# EAGLE design untitled (EAGLE 9.6.2)
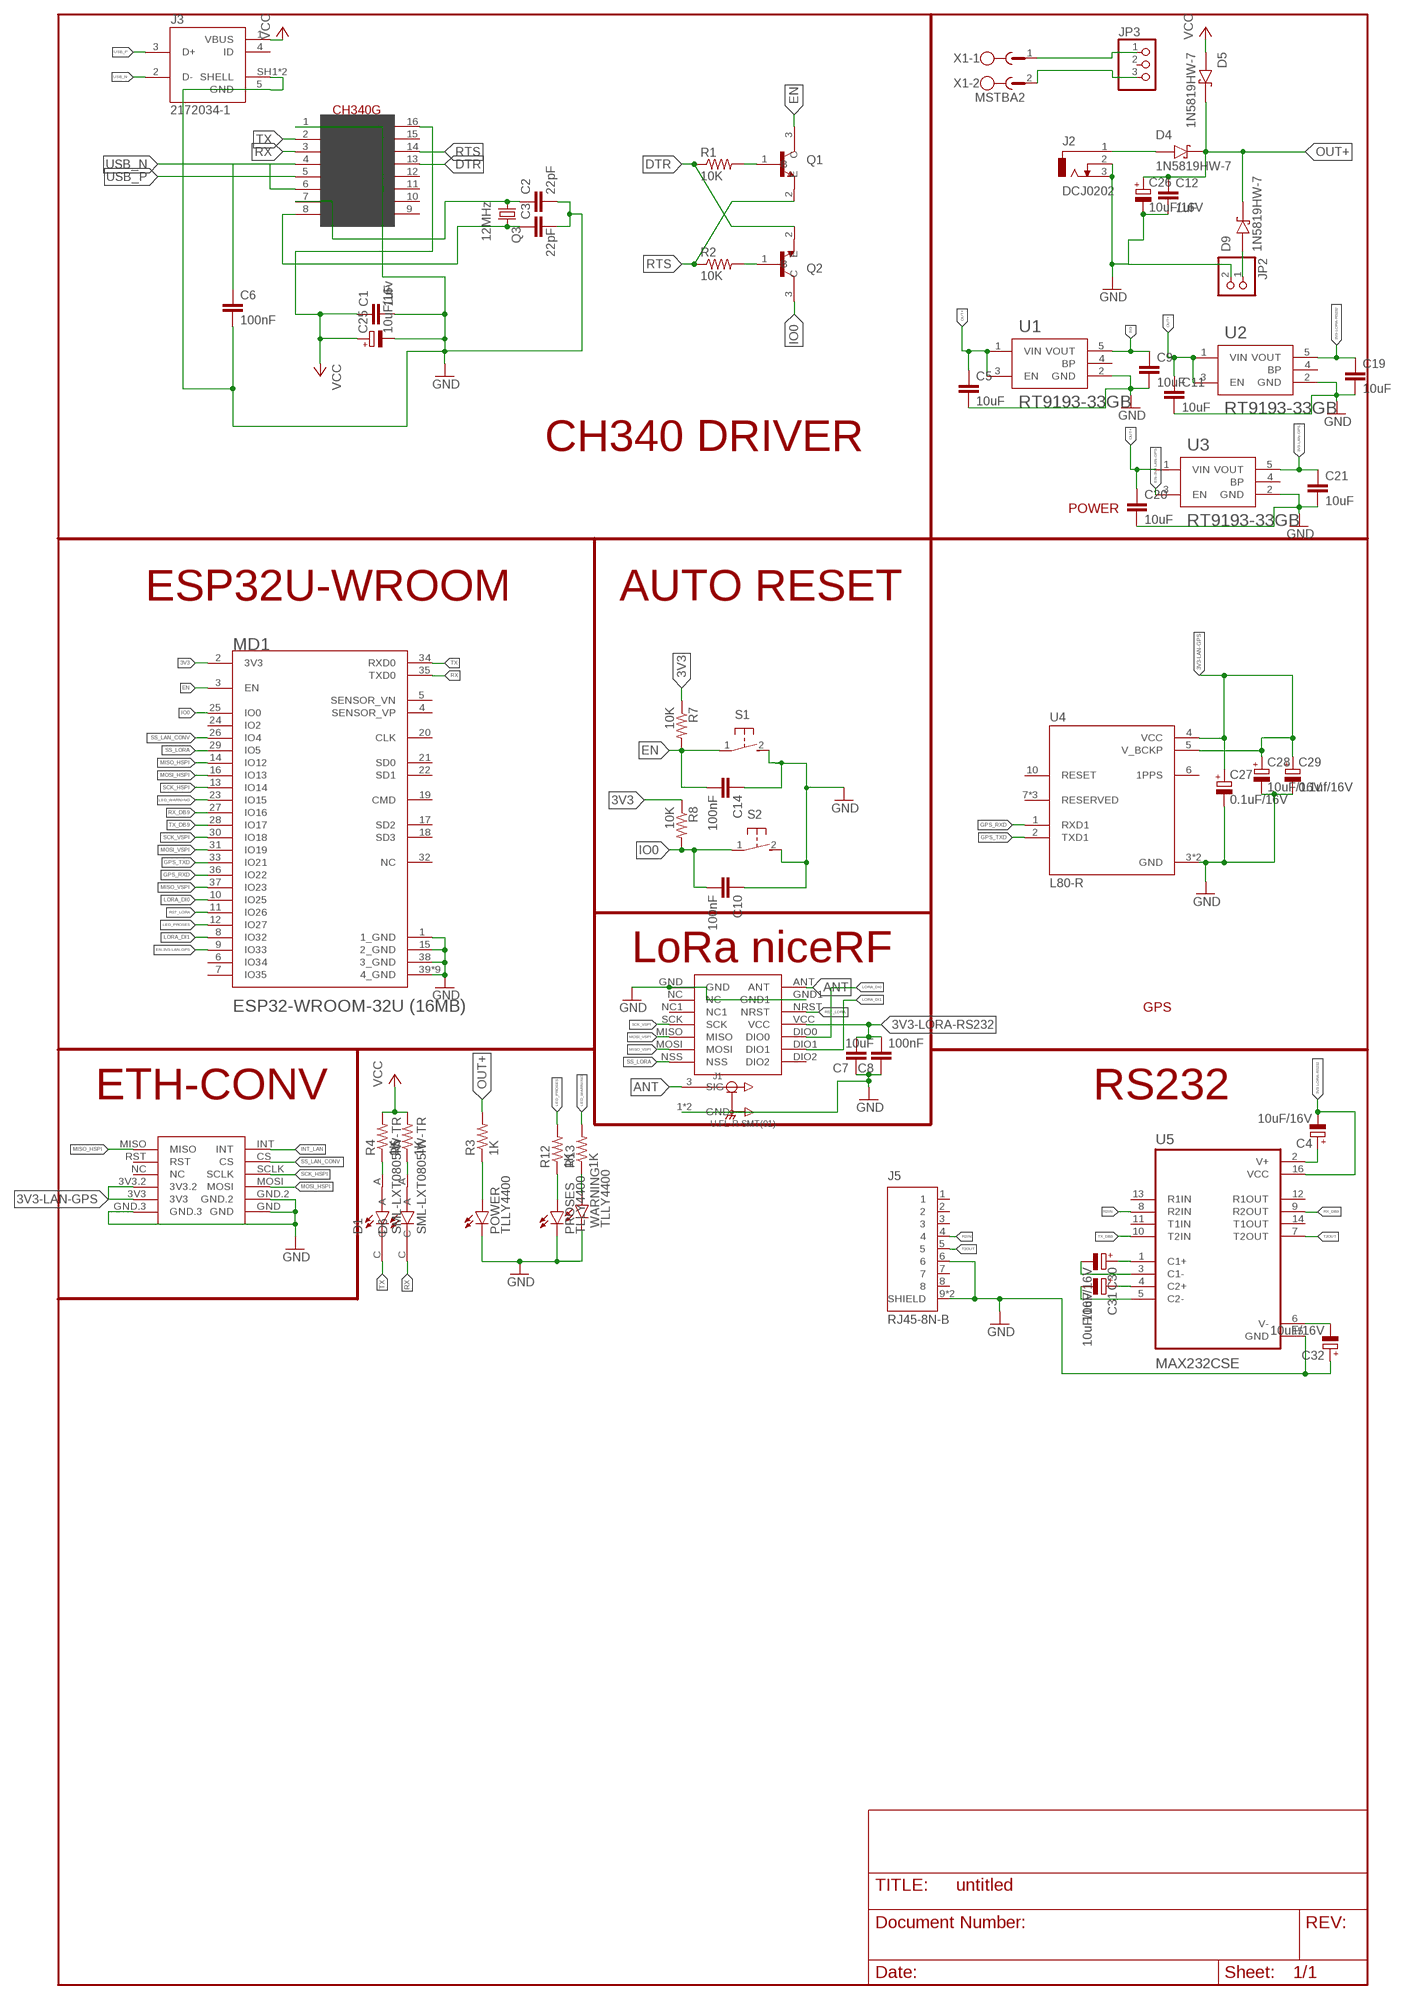
[diagram p0: schematic, sheet 1]

## Parts
C1  1uF  C-EUC0805K  [C0805K]
C2  22pF  C-EUC0805K  [C0805K]
C3  22pF  C-EUC0805K  [C0805K]
C4  10uF/16V  CPOL-EU153CLV-0505  [153CLV-0505]
C5  10uF  C-EUC0805K  [C0805K]
C6  100nF  C-EUC0805K  [C0805K]
C7  10uF  C-EUC0805K  [C0805K]
C8  100nF  C-EUC0805K  [C0805K]
C9  10uF  C-EUC0805K  [C0805K]
C10  100nF  C-EUC0805K  [C0805K]
C11  10uF  C-EUC0805K  [C0805K]
C12  1uF  C-EUC0805K  [C0805K]
C14  100nF  C-EUC0805K  [C0805K]
C19  10uF  C-EUC0805K  [C0805K]
C20  10uF  C-EUC0805K  [C0805K]
C21  10uF  C-EUC0805K  [C0805K]
C25  10uF/16v  CPOL-EU153CLV-0505  [153CLV-0505]
C26  10uF/16V  CPOL-EU153CLV-0505  [153CLV-0505]
C27  0.1uF/16V  CPOL-EU153CLV-0505  [153CLV-0505]
C28  10uF/16V  CPOL-EU153CLV-0505  [153CLV-0505]
C29  0.1uf/16V  CPOL-EU153CLV-0505  [153CLV-0505]
C30  10uF/16V  CPOL-EU153CLV-0505  [153CLV-0505]
C31  10uF/16V  CPOL-EU153CLV-0505  [153CLV-0505]
C32  10uF/16V  CPOL-EU153CLV-0505  [153CLV-0505]
D1  SML-LXT0805IW-TR  [LEDC2012X120N]
D4  1N5819HW-7  [SOD3715X145N]
D5  1N5819HW-7  [SOD3715X145N]
D6  SML-LXT0805IW-TR  [LEDC2012X120N]
D9  1N5819HW-7  [SOD3715X145N]
J1  U.FL-R-SMT(01)  [HRS_U.FL-R-SMT(01)]
J2  DCJ0202  [DCJ0202]
J3  2172034-1  [TE_2172034-1]
J5  RJ45-8N-B  [TE_RJ45-8N-B]
JP2  PINHD-1X2  [1X02]
JP3  PINHD-1X3  [1X03]
LORA-NICERF-V1  LORA-NICERF-V2  [LORA-NICERF-V2]
MD1  ESPRESSIF_SYSTEMS_ESP32-WROOM-32U_16MBESPRESSIF_SYSTEMS_ESP32-WROOM-32U_16MB_0_0  [ESPRESSIF_SYSTEMS_ESP32-WROOM-32U_16MB_0]
POWER  TLLY4400  [LED3MM]
PROSES  TLLY4400  [LED3MM]
Q1  MMBT3904  [SOT95P240X120-3N]
Q2  MMBT3904  [SOT95P240X120-3N]
Q3  12MHz  CRYSTALSM49  [SM49]
R1  10K  R-US_M0805  [M0805]
R2  10K  R-US_M0805  [M0805]
R3  1K  R-US_M0805  [M0805]
R4  1K  R-US_M0805  [M0805]
R5  1K  R-US_M0805  [M0805]
R7  10K  R-US_M0805  [M0805]
R8  10K  R-US_M0805  [M0805]
R12  1K  R-US_M0805  [M0805]
R13  1K  R-US_M0805  [M0805]
S1  31-XX  [B3F-31XX]
S2  31-XX  [B3F-31XX]
U1  RT9193-33GB  [SOT94P279X129-5N]
U2  RT9193-33GB  [SOT94P279X129-5N]
U3  RT9193-33GB  [SOT94P279X129-5N]
U4  L80-R  [XCVR_L80-R]
U5  MAX232CSE  [SOIC127P600X175-16N]
U$2  CH340G  [SOIC16]
U$3  MINI_W5500  [MINI_W5500]
WARNING  TLLY4400  [LED3MM]
X1  MSTBA2  [MSTBA2]

## Nets
3V3: C9.1 MD1.2(3V3) R7.1 R8.1 U1.5(VOUT)
3V3-LAN-GPS: C21.1 C27.+ C28.+ C29.+ U3.5(VOUT) U4.4(VCC) U4.5(V_BCKP) U$3.3V3 U$3.3V3.2
3V3-LORA-RS232: C4.- C7.2 C8.2 C19.1 LORA-NICERF-V1.VCC U2.5(VOUT) U5.16(VCC)
ANT: J1.3(SIG) LORA-NICERF-V1.ANT
DTR: Q2.2(E) R1.1 U$2.13(DTR)
EN: C14.2 MD1.3(EN) Q1.3(C) R7.2 S1.1(P)
EN-3V3-LAN-GPS: MD1.9(IO33) U3.3(EN)
GND: C1.2 C2.2 C3.2 C5.2 C6.2 C7.1 C8.1 C9.2 C10.1 C11.2 C12.2 C14.1 C19.2 C20.2 C21.2 C25.- C26.- C27.- C28.- C29.- C32.+ J1.1(GND) J1.2(GND) J2.2 J2.3 J3.5(GND) J3.SH1(SHELL) J3.SH2(SHELL) J5.6 J5.9(SHIELD) J5.10(SHIELD) JP2.2 LORA-NICERF-V1.GND LORA-NICERF-V1.GND1 MD1.1(1_GND) MD1.15(2_GND) MD1.38(3_GND) MD1.39(4_GND) MD1.39-2(4_GND) MD1.39-3(4_GND) MD1.39-4(4_GND) MD1.39-5(4_GND) MD1.39-6(4_GND) MD1.39-7(4_GND) MD1.39-8(4_GND) MD1.39-9(4_GND) POWER.K(C) PROSES.K(C) S1.2(S) S2.2(S) U1.2(GND) U2.2(GND) U3.2(GND) U4.3(GND) U4.12(GND) U5.15(GND) U$2.1(GND) U$3.GND U$3.GND.2 U$3.GND.3 WARNING.K(C)
GPS_RXD: MD1.36(IO22) U4.1(RXD1)
GPS_TXD: MD1.33(IO21) U4.2(TXD1)
INT_LAN: U$3.INT
IO0: C10.2 MD1.25(IO0) Q2.3(C) R8.2 S2.1(P)
LED_PROSES: MD1.12(IO27) R12.2
LED_WARNING: MD1.23(IO15) R13.2
LORA_DI0: LORA-NICERF-V1.DIO0 MD1.10(IO25)
LORA_DI1: LORA-NICERF-V1.DIO1 MD1.8(IO32)
MISO_HSPI: MD1.14(IO12) U$3.MISO
MISO_VSPI: LORA-NICERF-V1.MOSI MD1.37(IO23)
MOSI_HSPI: MD1.16(IO13) U$3.MOSI
MOSI_VSPI: LORA-NICERF-V1.MISO MD1.31(IO19)
N$1: C2.1 Q3.1 U$2.7(XI)
N$2: C3.1 Q3.2 U$2.8(XO)
N$3: POWER.A R3.1
N$4: Q1.1(B) R1.2
N$5: Q2.1(B) R2.2
N$6: D4.A J2.1
N$8: D1.A R4.1
N$9: D6.A R5.1
N$10: C30.+ U5.1(C1+)
N$12: C6.1 U$2.4(V3)
N$13: JP3.1 X1.1
N$14: C30.- U5.3(C1-)
N$16: JP3.3 X1.2
N$17: D9.A JP2.1
N$19: C31.+ U5.4(C2+)
N$24: C31.- U5.5(C2-)
N$25: PROSES.A R12.1
N$26: C4.+ U5.2(V+)
N$27: C32.- U5.6(V-)
N$28: R13.1 WARNING.A
OUT+: C5.1 C11.1 C12.1 C20.1 C26.+ D4.C(K) D5.C(K) D9.C(K) R3.2 U1.1(VIN) U1.3(EN) U2.1(VIN) U2.3(EN) U3.1(VIN)
R2IN: J5.4 U5.8(R2IN)
RST_LORA: LORA-NICERF-V1.NRST MD1.11(IO26)
RTS: Q1.2(E) R2.1 U$2.14(RTS)
RX: D6.C MD1.35(TXD0) U$2.3(RX)
RX_DB9: MD1.27(IO16) U5.9(R2OUT)
SCK_HSPI: MD1.13(IO14) U$3.SCLK
SCK_VSPI: LORA-NICERF-V1.SCK MD1.30(IO18)
SS_LAN_CONV: MD1.26(IO4) U$3.CS
SS_LORA: LORA-NICERF-V1.NSS MD1.29(IO5)
T2OUT: J5.5 U5.7(T2OUT)
TX: D1.C MD1.34(RXD0) U$2.2(TX)
TX_DB9: MD1.28(IO17) U5.10(T2IN)
USB_N: J3.2(D-) U$2.6(D-)
USB_P: J3.3(D+) U$2.5(D+)
VCC: C1.1 C25.+ D5.A J3.1(VBUS) R4.2 R5.2 U$2.16(VCC)
Unconnected: J3.4(ID) J5.1 J5.2 J5.3 J5.7 J5.8 JP3.2 LORA-NICERF-V1.DIO2 LORA-NICERF-V1.NC LORA-NICERF-V1.NC1 MD1.4(SENSOR_VP) MD1.5(SENSOR_VN) MD1.6(IO34) MD1.7(IO35) MD1.17(SD2) MD1.18(SD3) MD1.19(CMD) MD1.20(CLK) MD1.21(SD0) MD1.22(SD1) MD1.24(IO2) MD1.32(NC) U1.4(BP) U2.4(BP) U3.4(BP) U4.6(1PPS) U4.7(RESERVED) U4.8(RESERVED) U4.10(RESET) U4.11(RESERVED) U5.11(T1IN) U5.12(R1OUT) U5.13(R1IN) U5.14(T1OUT) U$2.9(CTS) U$2.10(DSR) U$2.11(RI) U$2.12(DCD) U$2.15(RS232) U$3.NC U$3.RST

## Notes on the sheet
- CH340 DRIVER
- POWER
- ESP32U-WROOM | AUTO RESET
- LoRa niceRF
- GPS
- ETH-CONV | RS232

## Library data of the parts
C1-C3 C5-C12 C14 C19-C21 = rcl:C-EU: CAPACITOR, European symbol; SPICEPREFIX: C
C4 C25-C32 = rcl:CPOL-EU: POLARIZED CAPACITOR, European symbol; SPICEPREFIX: C
D1 D6 = SML-LXT0805IW-TR:SML-LXT0805IW-TR: LED; Luminous Intensity:11µcd; Viewing Angle:140°; Forward Current:30mA; Forward Voltage:2V; Color:Red; LED Color:Red; Leaded Process Compatible:Yes; Lens Color:White; Mounting Type:Surface Mount ;RoHS Compliant: Yes Check availability <https://pricing.snapeda.com/parts/SML-LXT0805IW-TR/Lumex%20Opto/Components/view-part?ref=eda>; AVAILABILITY: In Stock; DESCRIPTION: Red - LED Indication - Discrete 2V 0805 (2012 Metric); MF: Lumex Opto/Components; MP: SML-LXT0805IW-TR; PACKAGE: 0805 Lumex; PRICE: None; PURCHASE-URL: https://pricing.snapeda.com/search/part/SML-LXT0805IW-TR/?ref=eda
D4 D5 D9 = 1N5819HW-7:1N5819HW-7: 1N5819HW Series 40 V 1 A Surface Mount Schottky Barrier Rectifier - SOD-123 Check availability <https://pricing.snapeda.com/parts/1N5819HW-7/Diodes%20Inc./view-part?ref=eda>; AVAILABILITY: In Stock; DESCRIPTION: Diode Schottky 40 V 1A Surface Mount SOD-123; MF: Diodes Inc.; MP: 1N5819HW-7; PACKAGE: SOD-123 Fairchild Semiconductor; PRICE: None; PURCHASE-URL: https://pricing.snapeda.com/search/part/1N5819HW-7/?ref=eda
J1 = U.FL-R-SMT_01_:U.FL-R-SMT(01): U.FL Series 6 Ghz 50 Ohm Ultra-small SMT Coaxial Cable Receptacle Check availability <https://pricing.snapeda.com/parts/U.FL-R-SMT%2801%29/Hirose/view-part?ref=eda>; AVAILABILITY: In Stock; DESCRIPTION: U.FL (UMCC) Connector Receptacle, Male Pin 50Ohm Surface Mount Solder. RF Connectors / Coaxial Connectors; MF: Hirose; MP: U.FL-R-SMT(01); PACKAGE: None; PRICE: None; PURCHASE-URL: https://pricing.snapeda.com/search/part/U.FL-R-SMT(01)/?ref=eda
J2 = con-jack:DCJ0202: DC POWER JACK Source: DCJ0202.pdf; OC_FARNELL: unknown; OC_NEWARK: unknown
J3 = 2172034-1:2172034-1: CONN RCPT USB MINI B 2.0 PCB R/A Check availability <https://pricing.snapeda.com/parts/2172034-1/TE%20Connectivity/view-part?ref=eda>; AVAILABILITY: In Stock; COMMENT: 2172034-1; DESCRIPTION: Conn Mini USB Type B RCP 5 POS 0.8mm Solder RA Thru-Hole 5 Terminal 1 Port Box/Tray; EU_ROHS_COMPLIANCE: Compliant; MF: TE Connectivity; MP: 2172034-1; PACKAGE: None; PRICE: None; PURCHASE-URL: https://pricing.snapeda.com/search/part/2172034-1/?ref=eda
J5 = RJ45-8N-B:RJ45-8N-B: RJ Jack / Signal Line EMI/RFI Filters 6 TERM LOW PROFILE BLOCK INDUCTOR 8 PIN Check availability <https://pricing.snapeda.com/parts/RJ45-8N-B/TE%20Connectivity/view-part?ref=eda>; AVAILABILITY: In Stock; DESCRIPTION: Jack Modular Connector 8p8c (RJ45, Ethernet) 90° Angle (Right) Unshielded -; MF: TE Connectivity; MP: RJ45-8N-B; PACKAGE: None; PRICE: None; PURCHASE-URL: https://pricing.snapeda.com/search/part/RJ45-8N-B/?ref=eda
JP2 = pinhead:PINHD-1X2: PIN HEADER
JP3 = pinhead:PINHD-1X3: PIN HEADER
LORA-NICERF-V1 = LORA-NICERF-V2:LORA-NICERF-V2
MD1 = Espressif Systems - ESP32-WROOM-32U (16MB):ESPRESSIF_SYSTEMS_ESP32-WROOM-32U_16MB: Bluetooth, WiFi 802.11b/g/n, Bluetooth v4.2 +EDR, Class 1, 2 and 3 Transceiver Module 2.4GHz ~ 2.5GHz Antenna Not Included, U.FL Surface Mount; AUTOMOTIVE: No; BANDWIDTH: 72MHz; CENTROID_NOT_SPECIFIED: No; DATASHEET: https://www.espressif.com/sites/default/files/documentation/esp32-wroom-32d_esp32-wroom-32u_datasheet_en.pdf; DATA_RATE: 150Mbits/s; DEVICE_CLASS_L1: Integrated Circuits (ICs); DEVICE_CLASS_L2: RF Semiconductors and Devices; DEVICE_CLASS_L3: Transceivers; DIGIKEY_DESCRIPTION: RX TXRX MODULE WIFI U.FL SMD; DIGIKEY_PART_NUMBER: 1904-1028-1-ND; FOOTPRINT_VARIANT_NAME_0: Recommended_Land_Pattern; HEIGHT: 3.35mm; INTERFACE: I2C,SPI,UART,Ethernet,I2S,Other; LEAD_FREE: Yes; MAX_FREQUENCY: 2484MHz; MAX_SUPPLY_VOLTAGE: 3.6V; MF: Espressif Systems; MFG_PACKAGE_IDENT: 0; MFG_PACKAGE_IDENT_DATE: 0; MFG_PACKAGE_IDENT_REV: 0; MIN_SUPPLY_VOLTAGE: 3V; MOUSER_PART_NUMBER: 356-ES32WROOM32U16MB; MPN: ESP32-WROOM-32U (16MB); NOMINAL_SUPPLY_CURRENT: 0.5A; NUMBER_OF_ADC_CHANNELS: 16; NUMBER_OF_GPIO: 26; PACKAGE: BT_MODULE; PREFIX: MD; ROHS: Yes; SENSITIVITY: -98dBm; TEMPERATURE_RANGE_HIGH: +85°C; TEMPERATURE_RANGE_LOW: -40°C; VERIFICATION_VERSION: 0.0.0.3
POWER PROSES WARNING = led:TLLY4400: Low Current (2mA) LED 3 mm Tinted Diffused Package color YELLOW Source: Data sheet <http://www.farnell.com/datasheets/391098.pdf>; MF: VISHAY SEMICONDUCTOR; OC_FARNELL: 1612439
Q1 Q2 = MMBT3904:MMBT3904: MMBT3904 Series 40 V CE Breakdown 0.2 A NPN General Purpose Amplifier - SOT-23 Check availability <https://pricing.snapeda.com/parts/MMBT3904/STMicroelectronics/view-part?ref=eda>; AVAILABILITY: Not in stock; DESCRIPTION: SMD Transistor MMBT3904 SOT-23 SMD DIOTEC; MF: STMicroelectronics; MP: MMBT3904; PACKAGE: SOT-23 ON; PRICE: None
Q3 = adafruit:CRYSTAL: CRYSTAL; OC_FARNELL: unknown; OC_NEWARK: unknown
R1-R5 R7 R8 R12 R13 = adafruit:R-US_: RESISTOR, American symbol
S1 S2 = switch-omron:31-XX: OMRON SWITCH; MPN: B3F-3100; OC_FARNELL: 959704; OC_NEWARK: 36M3582
U1-U3 = RT9193-33GB:RT9193-33GB: RT9193 Series 300 mA 3.3 V Ultra-Low Noise Ultra-Fast CMOS LDO Regulator-SC-70-5 Check availability <https://pricing.snapeda.com/parts/RT9193-33GB/Richtek%20USA%20Inc./view-part?ref=eda>; AVAILABILITY: In Stock; DESCRIPTION: Linear Voltage Regulator IC Positive Fixed 1 Output 300mA SOT-23-5; MF: Richtek USA Inc.; MP: RT9193-33GB; PACKAGE: SOT-23-5 Richtek; PRICE: None; PURCHASE-URL: https://pricing.snapeda.com/search/part/RT9193-33GB/?ref=eda
U4 = L80-R:L80-R: Check availability <https://pricing.snapeda.com/parts/L80-R/Quectel/view-part?ref=eda>; AVAILABILITY: In Stock; DESCRIPTION: L80-R is an ultra compact GPS POT (Patch on Top) module with an embedded 15.0mm × 15.0mm × 4.0mm patch antenna; MF: Quectel; MP: L80-R; PACKAGE: None; PRICE: None
U5 = MAX232CSE:MAX232CSE: Check availability <https://pricing.snapeda.com/parts/MAX232CSE/Maxim%20Integrated/view-part?ref=eda>; AVAILABILITY: In Stock; DESCRIPTION: 2/2 Transceiver Full RS232 16-SOIC; MF: Maxim Integrated; MP: MAX232CSE; PACKAGE: SOIC-16 Maxim Integrated; PRICE: None; PURCHASE-URL: https://pricing.snapeda.com/search/part/MAX232CSE/?ref=eda
U$2 = usb-serial:CH340G
U$3 = ethernet-mikroavr:MINI_W5500: MINI ETHERNET W5500, CREATE BY MIKROAVR.COM
X1 = con-phoenix-508:MSTBA2: PHOENIX; MF: FARNELL; MPN: 1757242; OC_FARNELL: 3705171; OC_NEWARK: 71C4161

## Net classes
0 default: width 0.2 mm, clearance 0.2 mm

## Board
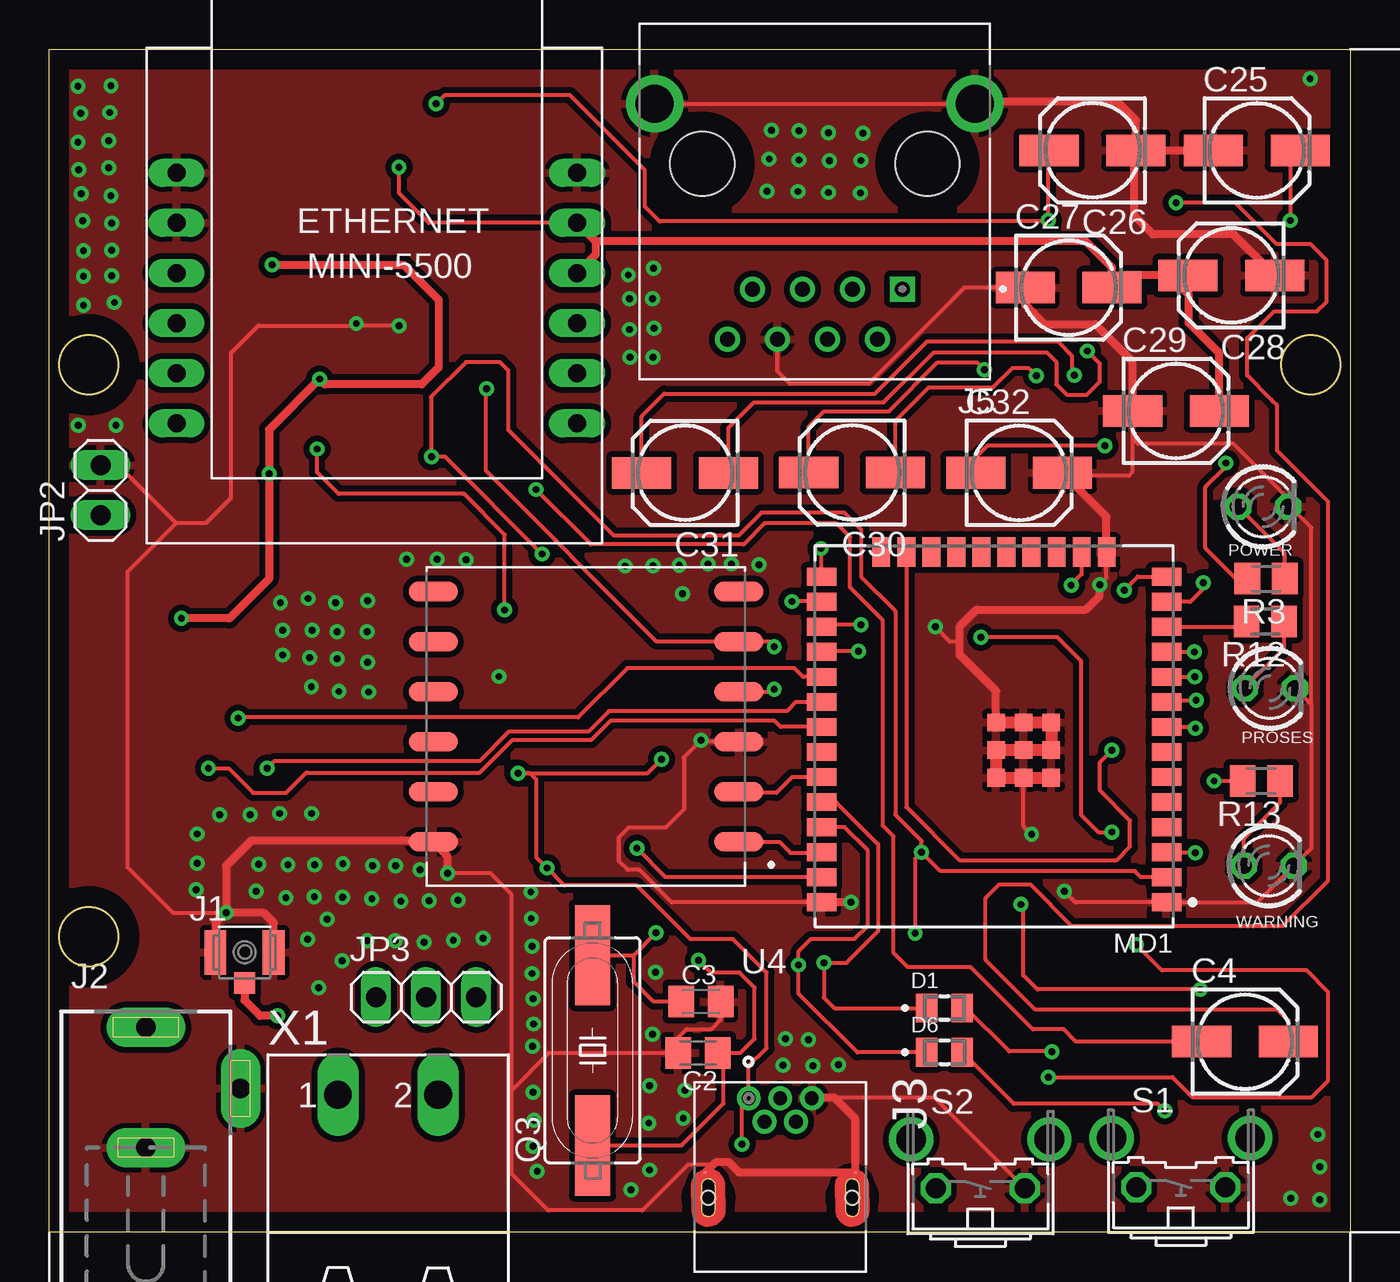
[diagram p1: board, top side]
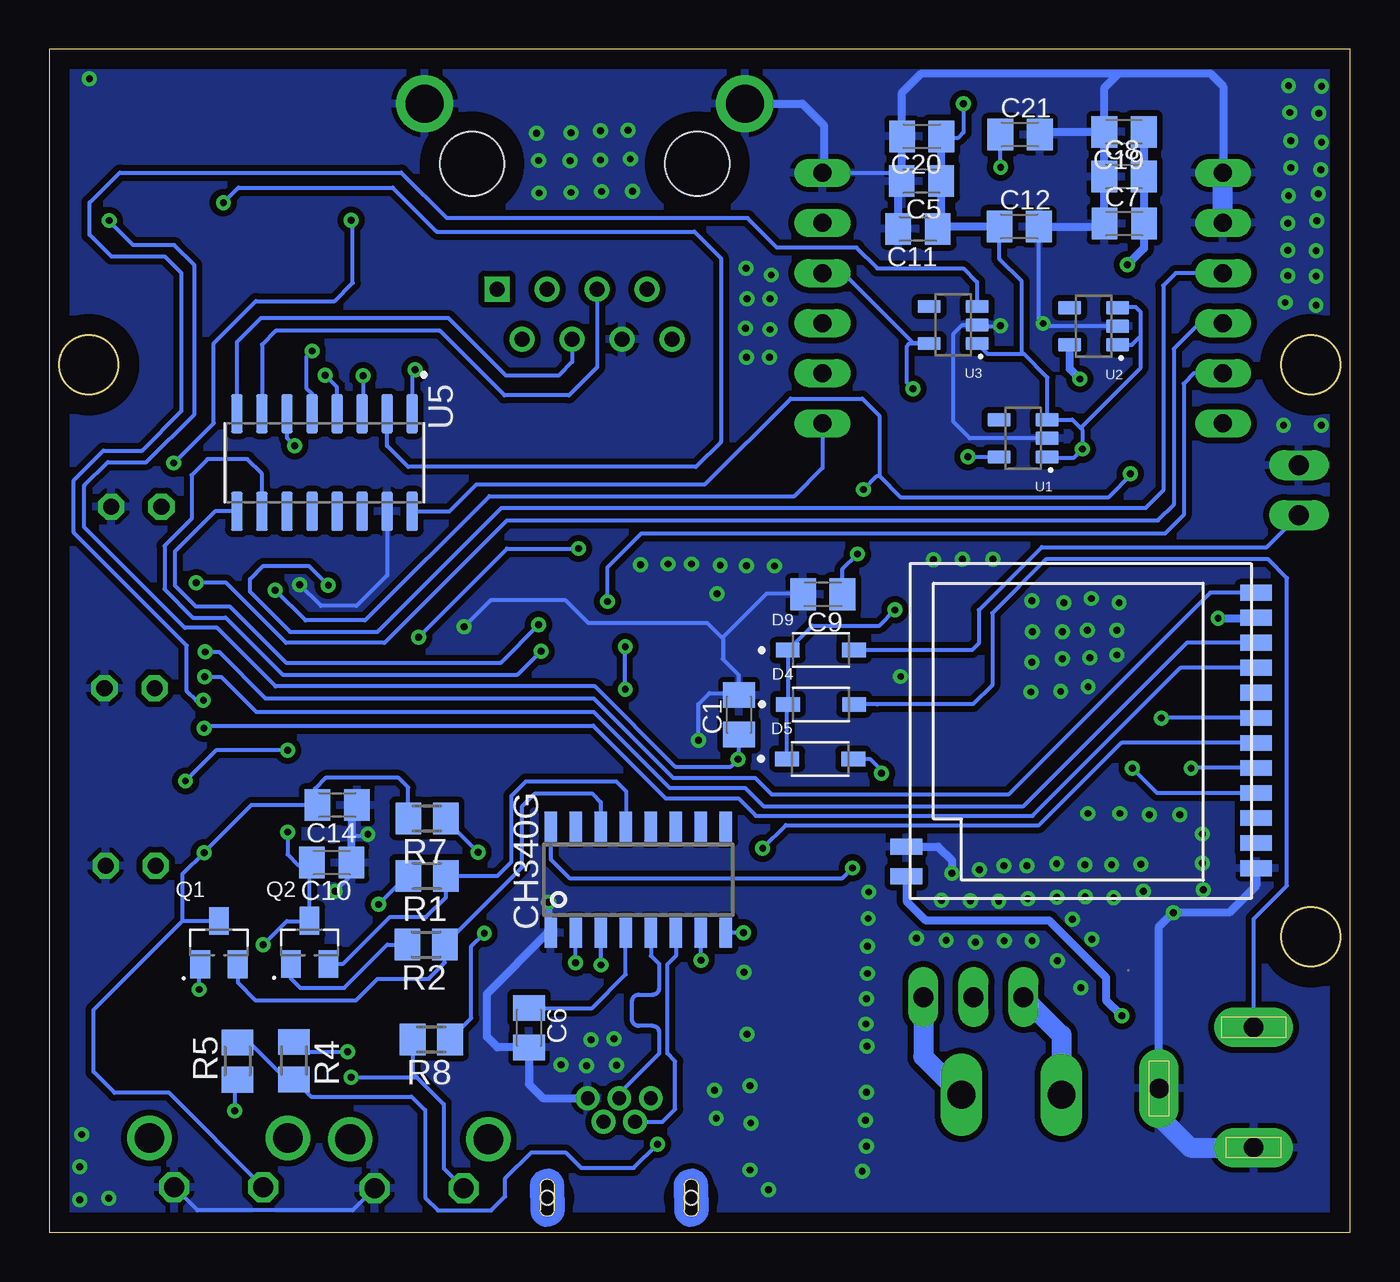
[diagram p2: board, bottom side, seen from below]

Size 66 x 60 mm. Coordinates in mm from the lower left corner, seen from the top.
Outline: 0,0 0,60 66,60 66,0 0,0
Outline: circle at 64,44 radius 1.5
Outline: circle at 2,15 radius 1.5
Outline: circle at 2,44 radius 1.5
Copper layers (1*16): Top 0.035mm / dielectric 1.5mm / Bottom 0.035mm
Design rules "default": minimum track width 6mil, minimum drill 0.35mm, track to track 6mil, track to pad 6mil, pad to pad 6mil, via to via 6mil, smd to smd 6mil, copper to edge 40mil, drill to drill 6mil, minimum pad ring 10mil, minimum via ring 8mil, stop-mask expansion 4mil, vias tented up to drill 0mil, thermal gap 10mil

### Footprints (pad centres in the part's own frame; a part is rotated, then mirrored left to right if it is on the bottom)
C0805K = smd 1.3 x 1.6: 1 -1,0; 2 1,0
153CLV-0505 = smd 3 x 1.6: + 2.2,0; - -2.2,0
LEDC2012X120N = smd 1.1 x 1.45: A 0.9,0; C -0.9,0
SOD3715X145N = smd 1.21 x 0.73: A 1.68,0; C -1.68,0
HRS_U.FL-R-SMT(01) = smd 1.1 x 2.25: 1 -1.475,0; 2 1.475,0 | smd 1.05 x 1.1: 3 0,-1.55
DCJ0202 = drill 1 pad 2 long: 1 0,3.1; 2 4.8,0; 3 0,-3
TE_2172034-1 = drill 0.7: 1 -5.05,-1.6; 2 -3.85,-0.8; 3 -5.05,0; 4 -3.85,0.8; 5 -5.05,1.6 | smd 0.1 x 0.1: SH1 -1.27,3.81; SH2 -1.27,-3.81 | hole 0.7: 0,3.65; 0,-3.65
TE_RJ45-8N-B = drill 0.76 square: 1 -4.445,6.35 | drill 0.76: 2 -3.175,8.89; 3 -1.905,6.35; 4 -0.635,8.89; 5 0.635,6.35; 6 1.905,8.89; 7 3.175,6.35; 8 4.445,8.89 | drill 1.93: 9 -8.125,-3.05; 10 8.125,-3.05 | hole 3.25: -5.715,0; 5.715,0
1X02 = drill 1.016 long: 1 -1.27,0; 2 1.27,0
1X03 = drill 1.016 long: 1 -2.54,0; 2 0,0; 3 2.54,0
LORA-NICERF-V2 = smd 1.6 x 0.8: ANT 9.17,6.81; DIO0 -8.57,-5.03; DIO1 -8.57,-3.76; DIO2 -8.57,-2.49; GND -8.57,6.4; GND1 9.17,5.31; MISO -8.57,1.32; MOSI -8.57,0.05; NC -8.57,5.13; NC1 -8.57,3.86; NRST -8.57,-7.57; NSS -8.57,-1.22; SCK -8.57,2.59; VCC -8.57,-6.3
ESPRESSIF_SYSTEMS_ESP32-WROOM-32U_16MB_0 = smd 1.5 x 0.9: 1 -8.75,8.41; 2 -8.75,7.14; 3 -8.75,5.87; 4 -8.75,4.6; 5 -8.75,3.33; 6 -8.75,2.06; 7 -8.75,0.79; 8 -8.75,-0.48; 9 -8.75,-1.75; 10 -8.75,-3.02; 11 -8.75,-4.29; 12 -8.75,-5.56; 13 -8.75,-6.83; 14 -8.75,-8.1; 25 8.75,-8.1; 26 8.75,-6.83; 27 8.75,-5.56; 28 8.75,-4.29; 29 8.75,-3.02; 30 8.75,-1.75; 31 8.75,-0.48; 32 8.75,0.79; 33 8.75,2.06; 34 8.75,3.33; 35 8.75,4.6; 36 8.75,5.87; 37 8.75,7.14; 38 8.75,8.41 | smd 0.9 x 1.5: 15 -5.71,-9.35; 16 -4.44,-9.35; 17 -3.17,-9.35; 18 -1.9,-9.35; 19 -0.63,-9.35; 20 0.64,-9.35; 21 1.91,-9.35; 22 3.18,-9.35; 23 4.45,-9.35; 24 5.72,-9.35 | smd 0.9 x 0.9: 39 -2.9,2.09; 39-2 -1.5,0.69; 39-3 -1.5,2.09; 39-4 -0.1,2.09; 39-5 -0.1,-0.71; 39-6 -1.5,-0.71; 39-7 -2.9,-0.71; 39-8 -0.1,0.69; 39-9 -2.9,0.69
LED3MM = drill 0.813 octagon: A -1.27,0; K 1.27,0
SOT95P240X120-3N = smd 1 x 1.4: 1 -0.95,-1.1; 2 0.95,-1.1; 3 0,1.1
SM49 = smd 5.08 x 1.778: 1 -4.826,0; 2 4.826,0
M0805 = smd 1.3 x 1.6: 1 -0.95,0; 2 0.95,0
B3F-31XX = drill 1.016 octagon: 1 -2.261,-1.245; 2 2.261,-1.245 | drill 1.499 pad 2.159: 3 -3.505,1.245; 4 3.505,1.245
SOT94P279X129-5N = smd 1.17 x 0.67: 1 -1.22,0.94; 2 -1.22,0; 3 -1.22,-0.94; 4 1.22,-0.94; 5 1.22,0.94
XCVR_L80-R = smd 2.5 x 1: 1 -7.75,6.35; 2 -7.75,3.81; 3 -7.75,1.27; 4 -7.75,-1.27; 5 -7.75,-3.81; 6 -7.75,-6.35; 7 7.75,-6.35; 8 7.75,-3.81; 9 7.75,-1.27; 10 7.75,1.27; 11 7.75,3.81; 12 7.75,6.35
SOIC127P600X175-16N = smd 1.97 x 0.59: 1 -2.475,4.445; 2 -2.475,3.175; 3 -2.475,1.905; 4 -2.475,0.635; 5 -2.475,-0.635; 6 -2.475,-1.905; 7 -2.475,-3.175; 8 -2.475,-4.445; 9 2.475,-4.445; 10 2.475,-3.175; 11 2.475,-1.905; 12 2.475,-0.635; 13 2.475,0.635; 14 2.475,1.905; 15 2.475,3.175; 16 2.475,4.445
SOIC16 = smd 0.635 x 1.524: 1 -4.445,-2.695; 2 -3.175,-2.695; 3 -1.905,-2.695; 4 -0.635,-2.695; 5 0.635,-2.695; 6 1.905,-2.695; 7 3.175,-2.695; 8 4.445,-2.695; 9 4.445,2.695; 10 3.175,2.695; 11 1.905,2.695; 12 0.635,2.695; 13 -0.635,2.695; 14 -1.905,2.695; 15 -3.175,2.695; 16 -4.445,2.695
MINI_W5500 = drill 0.914 long: 3V3 21.844,-8.89; 3V3.2 21.844,-11.43; CS 1.524,-16.51; GND 1.524,-6.35; GND.2 1.524,-8.89; GND.3 21.844,-6.35; INT 1.524,-19.05; MISO 21.844,-19.05; MOSI 1.524,-11.43; NC 21.844,-13.97; RST 21.844,-16.51; SCLK 1.524,-13.97
MSTBA2 = drill 1.397 long: 1 -2.54,5.08; 2 2.54,5.08

### Placement (x,y rotation side)
C1  31.01,26.25 90 bottom
C2  32.9,9.1 180 top
C3  33.06,11.71 0 top
C4  60.66,9.67 0 top
C5  21.75,53.32 180 bottom
C6  41.66,10.38 270 bottom
C7  11.46,51.16 0 bottom
C8  11.47,53.55 0 bottom
C9  26.76,32.36 180 bottom
C10  51.67,18.75 180 bottom
C11  21.93,50.89 180 bottom
C12  16.79,51.01 0 bottom
C14  51.39,21.67 180 bottom
C19  11.47,55.81 180 bottom
C20  21.74,55.59 180 bottom
C21  16.75,55.68 0 bottom
C25  61.26,54.88 0 top
C26  52.93,54.88 180 top
C27  51.71,47.92 0 top
C28  59.97,48.53 180 top
C29  57.16,41.67 0 top
C30  40.73,38.54 180 top
C31  32.25,38.52 180 top
C32  49.2,38.52 0 top
D1  45.41,11.38 0 top
D4  26.85,26.78 0 bottom
D5  26.89,24.02 0 bottom
D6  45.42,9.14 0 top
D9  26.86,29.53 0 bottom
J1  9.91,14.2 0 top
J2  4.9,7.3 0 top
J3  37.08,1.76 270 top
J5  38.84,54.19 180 top
JP2  2.6,37.64 90 top
JP3  19.11,11.93 0 top
LORA-NICERF-V1  13.34,24.87 180 bottom
MD1  47.93,25.15 180 top
POWER  61.58,36.81 0 top
PROSES  61.93,27.6 0 top
Q1  57.39,14.7 0 bottom
Q2  52.8,14.7 0 bottom
Q3  27.56,9.23 90 top
R1  46.84,18.08 180 bottom
R2  46.88,14.59 180 bottom
R3  61.73,33.16 180 top
R4  53.59,8.71 270 bottom
R5  56.45,8.69 90 bottom
R7  46.84,20.99 180 bottom
R8  46.62,9.79 180 bottom
R12  61.69,30.98 180 top
R13  61.49,22.89 180 top
S1  57.41,3.55 0 top
S2  47.23,3.48 0 top
U1  16.59,40.27 180 bottom
U2  13.01,45.95 180 bottom
U3  20.15,46.02 180 bottom
U4  27.23,26.15 180 top
U5  52.03,39.04 270 bottom
U$2  36.12,17.88 0 bottom
U$3  4.93,60.08 0 top
WARNING  61.87,18.6 0 top
X1  17.18,1.9 0 top

### Tracks (layer width: path | path; a pad name or v marks a point on that pad's centre or on a via)
3V3  (via drill 0.35)
  Top 0.2: v25.01,34.4 20.07,39.34 v19.39,39.34 19.37,39.36 19.37,42.37 21.14,44.14 22.86,44.14 23.3,43.7 23.3,40.69 28.65,35.34 34.97,35.34 36.13,36.5 40.33,36.5 41.2,35.64 41.2,33.24 42.92,31.51 42.92,21.19 44.25,19.86 v44.25,19.28 | MD1.2 55.39,18.01 55.08,18.32 45.22,18.32 v44.25,19.28 | v44.25,19.28 43.93,18.96 v43.93,15.18
  Bottom 0.2: 25.6,32.52 C9.1 25.76,33.65 v25.01,34.4 | v19.39,39.34 U1.5 | R7.1 45.89,20.92 v44.25,19.28 | R8.1 44.59,10.86 44.59,14.51 v43.93,15.18
3V3-LAN-GPS  (via drill 0.35)
  Top 0.2: U$3.3V3 19.24,51.19 17.74,52.7 v17.74,54.02 | v22.19,42.79 22.15,42.75 22.15,38.63 30.82,29.96 U4.5 36.52,29.96 v36.78,29.71 | U4.4 36.66,27.42 v36.78,27.55
  Top 0.406: C29.+ 59.36,44.58 57.81,46.13 57.81,47.57 57.77,47.61 | 27.71,50.25 52.6,50.25 53.91,48.94 C27.+ 54.52,48.53 C28.+ 57.77,47.61 | 27.71,50.25 U$3.3V3 | 27.71,50.25 27.71,49.59 U$3.3V3.2 | 57.77,47.61 57.46,47.92
  Bottom 0.2: U$3.3V3.2 25.72,48.65 22.15,45.08 U3.5 22.35,45.08 22.51,44.92 22.51,43.11 v22.19,42.79 | v17.74,54.02 17.74,55.67 C21.1 | v36.78,27.55 v36.78,29.71
3V3-LORA-RS232  (via drill 0.35)
  Top 0.2: C4.- 52.09,9.67 51.47,10.3 49.91,10.3 46.76,13.45 43.55,13.45 42.83,14.17 42.83,20.09 42.29,20.63 42.29,31.05 40.62,32.72 40.62,35.27 39.94,35.95 36.3,35.95 35.23,34.89 27.48,34.89 v24.69,37.67
  Top 0.406: v11.31,49.07 17.98,49.07 19.76,47.29 19.76,43.87 18.89,43.01 13.99,43.01 v13.72,43.28 11.15,40.71 v11.15,38.47 11.15,33.14 9.15,31.14 v6.7,31.14
  Bottom 0.2: U5.16 45.69,36.57 44.33,37.93 32.74,37.93 28.38,42.29 24.76,42.29 23.89,41.42 23.89,38.36 | 23.89,38.36 22.82,37.29 12.24,37.29 11.07,38.47 v11.15,38.47 | v24.69,37.67 24.01,38.36 23.89,38.36
  Bottom 0.406: C19.1 | C19.1 C8.2 C7.2 10.46,49.91 v11.31,49.07 | v13.72,43.28 14.23,43.79 U2.5 | v6.7,31.14 4.81,31.14 LORA-NICERF-V1.VCC
ANT  (via drill 0.35)
  Top 0.406: v11.59,10.98 10.69,10.98 9.91,11.76 J1.3
  Bottom 0.406: LORA-NICERF-V1.ANT 22.51,16.81 21.52,15.81 15.27,15.81 12.39,12.94 12.39,11.78 v11.59,10.98
DTR
  Bottom 0.2: Q2.2 51.11,13.6 48.74,15.97 46.9,15.97 45.89,16.98 R1.1 43.26,18.08 42.55,18.79 42.55,22.14 41.82,22.87 37.24,22.87 36.74,22.37 U$2.13
EN  (via drill 0.35)
  Top 0.2: v58.15,19.26 56.7,19.26 MD1.3
  Bottom 0.2: S1.1 59.92,7.07 62.69,7.07 63.75,8.14 63.75,11.29 59.23,15.81 | 59.23,15.81 Q1.3 | R7.2 47.79,22.56 48.27,23.05 51.98,23.05 52.52,22.51 52.52,21.67 | 59.23,15.81 59.23,18.18 v58.15,19.26 58.15,19.27 55.75,21.67 52.52,21.67 | 52.41,21.66 C14.2 52.52,21.67
EN-3V3-LAN-GPS  (via drill 0.35)
  Top 0.2: MD1.9 56.76,26.98 v58.18,26.98
  Bottom 0.2: v58.18,26.98 58.56,26.98 59.03,27.45 59.03,29.76 64.76,35.49 64.76,38.15 63.26,39.65 61.3,39.65 59.29,41.66 59.29,48.65 60.12,49.49 62.84,49.49 63.95,50.59 63.95,52.22 62.43,53.75 48.14,53.75 45.83,51.44 30.57,51.44 29.09,49.95 25.05,49.95 23.99,48.89 19.63,48.89 18.93,48.2 U3.3
GND  (via drill 0.35)
  Top 0.2: WARNING.K 63.8,19.26 | WARNING.K 61.28,16.74 MD1.1 52.06,16.74 v51.5,17.3 | C3.2 34.06,10.78 33.59,10.31 32.34,10.31 31.9,9.87 C2.2 25.36,9.1 23.45,7.19 | C29.- 54.96,41.64 54.96,40.27 | 62.23,48.46 C28.- | v53.29,32.85 53.64,33.2 MD1.15 | C27.- 46.43,47.92 41.55,43.04 37.58,43.04 36.94,43.68 J5.6 | v17.75,45.99 15.58,45.99 | 15.58,45.99 v15.58,46.09 | v49.84,20.19 49.43,20.59 MD1.39-3 | JP2.2 3.49,38.91 6.43,35.97 | 6.43,35.97 7.94,35.97 9.22,37.25 9.22,44.61 10.6,45.99 15.58,45.99 | 33.68,3.44 32.41,3.44 30.09,1.12 25.31,1.12 23.45,2.98 23.45,7.19 | 23.45,7.19 23.42,7.16 | 23.45,7.19 23.45,17.15 22.38,18.22 v20.21,18.22 | MD1.38 31.58,16.74 29.94,18.38 29.35,18.38 28.9,18.83 28.9,20.03 29.4,20.53 31.27,20.53 32.19,21.45 32.19,24.08 v33.06,24.96 33.14,24.88 U4.3 34.98,24.76 34.44,24.76 | S2.2 44.89,6.83 39.82,6.83 | 6.43,35.97 3.95,33.49 3.95,18.53 6.29,16.2 8.97,16.2 v8.98,16.21 | 54.96,40.27 55.23,39.99 60.07,39.99 62.85,37.22 POWER.K 62.88,36.83 62.93,36.83 64.03,35.73 64.03,26.77 64.02,26.78 | 54.96,40.27 54.96,38.56 54.77,38.37 51.56,38.37 51.55,38.38 | v44.95,30.7 45.68,29.98 46.2,29.98 | PROSES.K 64.02,26.78 | WARNING.K 64.02,19.48 64.02,26.78 | J5.10 J5.9
  Top 0.406: J1.2 11.39,15.69 10.87,16.21 9.09,16.21 | 9.09,16.21 v8.98,16.21 8.91,16.21 8.43,15.74 J1.1 | v20.21,18.22 20.21,19.07 U4.12 19.41,19.87 10.25,19.87 8.97,18.59 8.97,16.33 9.09,16.21 | MD1.15 53.64,36.29 51.55,38.38 C32.+ | C26.- C25.- 59.03,54.84 | 62.17,49.1 C28.- 60.08,50.61 55.99,50.61 55.06,51.55 55.06,54.81 C26.- | C27.- 49.51,47.04 50.5,46.06 53.07,46.06 54.96,44.17 54.96,41.64 | C26.- 55.13,56.4 54.19,57.33 47.06,57.33 J5.9 | v40.68,16.73 MD1.38 | J3.SH1 | J3.SH1 40.9,5.76 39.82,6.83 38.71,6.83 J3.5 | J3.SH1 35.02,3.03 34.49,3.56 33.8,3.56 33.68,3.44 J3.SH2 33.43,3.18 | MD1.39-5 48.03,27.46 46.2,29.29 46.2,29.98 46.2,30.74 47.04,31.58 52.58,31.58 53.29,32.3 v53.29,32.85
  Top 0.61: MD1.39-5 MD1.39-6 MD1.39-7 MD1.39-9 MD1.39-2 MD1.39-8 MD1.39-4 MD1.39-3 MD1.39
  Bottom 0.2: S2.2 50.61,1.12 58.48,1.12 S1.2 | 11.82,45.98 U2.2 15.44,45.95 v15.58,46.09 15.79,46.31 C12.2 | U5.15 48.86,33.32 50.41,31.77 52.21,31.77 v53.29,32.85 | U$3.GND.3 26.7,53.73 23.17,53.73 C5.2 | U1.2 19.3,40.27 20.13,41.1 20.13,45.57 19.68,46.02 U3.2 18.87,45.96 17.77,45.96 v17.75,45.99 | 31.8,29.04 31.8,30.09 | 31.8,30.09 31.8,30.2 29.6,32.41 27.8,32.41 C9.2 | 31.84,29.08 31.8,29.04 | 31.8,29.04 31.01,28.25 C1.2 31.1,27.34 32.51,27.34 33.06,26.79 v33.06,24.96 | 50.67,20.11 49.91,20.11 v49.84,20.19 | v51.5,17.3 50.67,18.13 C10.1 | 31.8,30.09 32.61,30.9 38.65,30.9 39.8,32.05 43.6,32.05 v44.95,30.7
  Bottom 0.406: J3.5 40.95,6.81 41.66,7.52 C6.2 43.26,9.38 43.8,9.92 43.8,12.1 40.72,15.19 U$2.1 40.68,15.3 v40.68,16.73 | LORA-NICERF-V1.GND1 20.91,19.56 20.21,18.86 v20.21,18.22 | LORA-NICERF-V1.GND 4.77,17.59 6.14,16.22 9,16.22 9,16.21 | 9,16.21 v8.98,16.21 | C11.2 22.93,53.14 C5.2 22.75,55.58 C20.2 22.74,57.8 21.75,58.78 11.75,58.78 | C19.2 C8.1 C7.1 12.61,51.01 C12.2 | C19.2 | C19.2 12.47,58.06 11.75,58.78 | 11.75,58.78 7.11,58.78 6.45,58.12 U$3.GND | C21.2 15.61,55.81 C19.2 | C10.1 50.67,20.11 50.67,21.4 C14.1 | J5.10 27.8,57.24 26.7,56.15 26.7,53.73 | J2.2 9.7,15.51 9,16.21
  Bottom 1.016: U$3.GND.2 U$3.GND | J2.2 9.7,5.9 8.1,4.3 J2.3
  other vias: 13.67,12.41 14.85,13.78 16.14,14.78 17.56,14.8 19.01,14.71 20.5,14.82 22,14.91 12,16.97 13.45,17.03 14.89,16.99 16.36,16.93 17.84,16.79 19.27,16.81 20.74,16.84 18.81,18.38 24.43,17.26 24.45,15.92 24.5,14.52 24.49,13.13 24.55,11.85 24.57,10.57 24.52,9.44 24.55,7.1 24.59,5.69 24.55,4.38 24.76,3.09 30.46,3.16 29.51,2.16 30.41,5.55 30.45,7.44 30.61,10.06 30.76,13.2 1.45,58.12 3.13,58.15 3.06,56.79 3.03,55.36 3.03,54 3.13,52.57 3.16,51.17 3.16,49.81 3.16,48.52 3.3,47.16 1.59,56.76 1.45,55.29 1.49,53.9 1.63,52.67 1.7,51.31 1.73,49.78 1.73,48.48 1.73,47.02 37.23,8.48 38.74,8.45 40.04,8.5 37.35,9.83 38.52,9.76 32.16,5.79 32.25,7.2 16.15,32.03 16.12,30.46 16.15,28.92 16.21,27.4 14.69,27.43 14.61,29.09 14.61,30.46 14.52,31.94 13.33,30.55 13.21,29.15 13.3,27.67 13.12,32.15 18.14,34.13 19.67,34.14 21.14,34.12 29.21,33.79 30.63,33.81 31.96,33.83 33.41,33.9 34.61,33.9 36.01,33.85 13.31,21.24 11.69,21.24 10.19,21.17 8.64,21.17 7.5,20.2 7.5,18.72 7.45,17.37 10.49,17.3 10.61,18.68 12.11,18.64 13.46,18.64 14.89,18.7 16.41,18.6 17.56,18.6 1.47,40.93 3.38,40.93 11.73,31.94 11.83,30.54 11.83,29.28 30.65,48.9 30.59,47.36 30.68,45.85 30.62,44.39 29.46,44.39 29.43,45.79 29.43,47.36 29.37,48.55 63.96,58.5 36.4,52.81 37.98,52.79 39.53,52.74 41.15,52.71 41.18,54.36 39.58,54.34 38.02,54.39 36.52,54.43 36.64,55.89 38.02,55.86 39.53,55.77 41.27,55.74 32.12,32.39 22.81,28.19 64.45,1.65 64.45,3.33 64.36,4.97 62.98,1.74 14.1,15.87 13.1,14.87
  pour Top (isolate 0.305): 0,60 66,60 66,0 0,0
  pour Bottom (isolate 0.305): 0,60 66,60 66,0 0,0
GPS_RXD
  Top 0.2: U4.1 37.05,19.8 37.6,19.25 39.15,19.25 MD1.36
GPS_TXD
  Top 0.2: MD1.33 37.68,23.09 36.89,22.29 35.03,22.29 U4.2
IO0  (via drill 0.35)
  Top 0.2: v53.92,20.3 53.21,20.3 52.34,21.18 52.34,28.98 51.13,30.19 v47.27,30.19 | v50.69,7.87 56.98,7.87 58,6.86 64.04,6.86 64.88,7.7 64.88,12.19 63.79,13.29 56.45,13.29 v55.15,14.59 | v39.15,34.68 39.15,33.28 MD1.25
  Bottom 0.2: S2.1 45.99,3.25 45.99,6.5 47.36,7.87 | 52.8,18.62 Q2.3 52.82,15.78 53.95,15.78 v55.15,14.59 | 52.8,18.62 C10.2 | v53.92,20.3 53.92,19.17 53.36,18.62 52.8,18.62 | v50.69,7.87 47.36,7.87 | R8.2 47.57,8.08 47.36,7.87 | v47.27,30.19 42.78,34.68 v39.15,34.68
LED_PROSES
  Top 0.2: MD1.12 60.47,30.71 R12.2
LED_WARNING  (via drill 0.35)
  Top 0.2: MD1.23 43.48,21.58 46.18,18.88 54.15,18.88 54.83,19.57 54.83,20.89 53.31,22.41 53.31,23.85 v53.9,24.44 | v59.09,22.89 R13.2
  Bottom 0.2: v53.9,24.44 57.54,24.44 v59.09,22.89
LORA_DI0  (via drill 0.35)
  Top 0.2: 56.65,28.14 MD1.10 v58.12,28.17
  Bottom 0.2: LORA-NICERF-V1.DIO0 8.29,29.9 16.57,21.62 29.77,21.62 30.7,22.54 34.53,22.54 38.38,26.39 55.5,26.39 57.27,28.17 v58.12,28.17
LORA_DI1  (via drill 0.35)
  Top 0.2: MD1.8 58.09,25.63 v58.15,25.56
  Bottom 0.2: LORA-NICERF-V1.DIO1 8.61,28.63 16.12,21.13 30.15,21.13 31.04,22.01 34.73,22.01 38.41,25.7 58.02,25.7 v58.15,25.56
MISO_HSPI  (via drill 0.35)
  Top 0.2: v54.54,32.58 55.22,33.25 MD1.14
  Bottom 0.2: U$3.MISO 26.77,38.77 28.2,37.34 43.67,37.34 49.98,31.03 53,31.03 v54.54,32.58
MISO_VSPI  (via drill 0.35)
  Top 0.2: MD1.37 31.27,18.01 v29.81,19.48
  Bottom 0.2: LORA-NICERF-V1.MOSI 11.62,24.82 15.79,20.65 28.63,20.65 v29.81,19.48
MOSI_HSPI  (via drill 0.35)
  Top 0.2: MD1.16 52.37,33.37 51.84,32.84 v51.84,32.82
  Bottom 0.2: v51.84,32.82 52.83,33.81 55.15,33.81 55.82,33.13 55.82,32.49 53.78,30.45 49.35,30.45 43.08,36.73 10.39,36.73 9.49,37.63 9.49,48.02 8.86,48.65 U$3.MOSI
MOSI_VSPI  (via drill 0.35)
  Top 0.2: v8.07,23.53 9.1,23.53 10.34,22.3 12.01,22.3 13.04,23.32 21.84,23.32 23.48,24.96 27.49,24.96 28.47,25.94 36.79,25.94 37.1,25.63 MD1.31
  Bottom 0.2: LORA-NICERF-V1.MISO 8.05,23.55 v8.07,23.53
N$1  (via drill 0.35)
  Top 0.2: Q3.1 32.08,4.41 34.22,6.54 34.22,8.79 C2.1 35.06,9.1 35.78,9.82 35.78,12.42 35.02,13.18 33.57,13.18 v32.95,13.8
  Bottom 0.2: v32.95,13.8 v32.94,13.81 U$2.7
N$2  (via drill 0.35)
  Top 0.2: Q3.2 29.65,14.06 | 29.65,14.06 v30.78,15.19 | C3.1 30.66,11.71 29.65,12.72 29.65,14.06
  Bottom 0.2: v30.78,15.19 U$2.8
N$3
  Top 0.2: R3.1 62.68,34.44 POWER.A
N$4  (via drill 0.35)
  Top 0.2: v58.4,12.32 50.13,12.32 49.42,13.03 49.42,16.5 v49.29,16.63
  Bottom 0.2: Q1.1 58.43,13.51 58.43,12.32 v58.4,12.32 | v49.29,16.63 47.84,18.08 R1.2
N$5
  Bottom 0.2: Q2.1 53.75,12.88 53.27,12.4 51.04,12.4 48.85,14.59 R2.2
N$6
  Bottom 0.2: D4.A 24,26.78 23.99,26.78 19.13,26.78 18.16,27.76 18.16,31.41 15.43,34.14 4.16,34.14 3.22,33.19 3.22,17.58 4.9,15.9 J2.1
N$8  (via drill 0.35)
  Top 0.2: D1.A 46.5,11.38 48.7,9.18 50.83,9.18 v50.86,9.16
  Bottom 0.2: R4.1 53.08,9.16 v50.86,9.16
N$9  (via drill 0.35)
  Top 0.2: D6.A 48.93,6.52 56.23,6.52 v56.59,6.16
  Bottom 0.2: R5.1 56.59,7.6 v56.59,6.16
N$10  (via drill 0.35)
  Top 0.2: C30.+ 38.53,40.86 39.3,41.64 42.59,41.64 45.07,44.12 47.06,44.12 v47.43,43.75
  Bottom 0.2: v47.43,43.75 47.59,43.6 U5.1
N$12
  Bottom 0.2: C6.1 38.46,11.38 36.75,13.09 U$2.4
N$13
  Bottom 1.016: JP3.1 14.64,10 X1.1
N$14  (via drill 0.35)
  Top 0.2: C30.- 42.93,41.16 44.62,42.85 47.88,42.85 48.88,43.85 49.68,43.85 v50.09,43.44
  Bottom 0.2: v50.09,43.44 50.09,41.56 U5.3
N$16
  Bottom 1.016: JP3.3 21.65,8.91 X1.2
N$17
  Bottom 0.2: JP2.1 4.22,34.75 15.65,34.75 18.84,31.55 18.84,29.88 19.19,29.53 D9.A
N$19  (via drill 0.35)
  Top 0.2: C31.+ 30.05,41.39 31.2,42.54 41.9,42.54 44.55,45.18 51.16,45.18 51.88,44.46 51.88,43.6 v52.01,43.47
  Bottom 0.2: v52.01,43.47 51.43,42.89 51.43,41.55 U5.4
N$24  (via drill 0.35)
  Top 0.2: C31.- 34.45,40.8 35.74,42.09 42.33,42.09 44.87,44.63 50.62,44.63 51.09,44.17 51.09,43.01 51.61,42.49 52.64,42.49 53.28,43.12 53.28,44.09 v52.67,44.7
  Bottom 0.2: v52.67,44.7 52.96,44.41 52.96,42.82 52.67,42.53 U5.5
N$25
  Top 0.2: PROSES.A 60.66,27.65 62.64,29.64 R12.1
N$26  (via drill 0.35)
  Top 0.2: C4.+ 62.86,10.74 62.3,11.3 50.04,11.3 47.5,13.83 47.5,16.94 48.21,17.65 49.77,17.65 51.86,15.55 62.59,15.55 64.88,17.84 64.88,37.06 62.3,39.64 62.3,41.94 62.23,42 62.11,42.11 62,42.23 60.78,43.46 60.78,45.35 62.14,46.71 64.32,46.71 64.81,47.2 64.81,49.29 63.99,50.11 62.28,50.11 60.17,52.22 v57.17,52.22
  Bottom 0.2: v57.17,52.22 56.41,52.98 48.58,52.98 46.35,50.75 33.27,50.75 31.93,49.41 31.93,40.08 33.19,38.82 47.79,38.82 48.86,39.89 U5.2
N$27  (via drill 0.35)
  Top 0.2: C32.- 47,39.31 47.59,39.89 v53.54,39.89
  Bottom 0.2: v53.54,39.89 53.94,40.28 U5.6
N$28
  Top 0.2: R13.1 62.44,21.8 60.57,19.94 60.57,18.63 WARNING.A
OUT+  (via drill 0.35)
  Top 0.2: v23.1,31.57 23.1,35.39 21.04,37.45 14.68,37.45 13.58,38.56 13.58,39.76 13.6,39.75 v13.6,39.73 | R3.2 60.2,33.16 58.66,34.7 58.66,37.8 59.69,38.83 v59.69,39.02 | C26.+ 50.68,54.83 v50.68,51.34 50.62,51.28 49.31,51.28 30.96,51.28 30.22,52.02 30.22,53.87 26.42,57.67 20.06,57.67 v19.62,57.23
  Bottom 0.2: D4.C | U2.1 11.08,45.01 10.62,45.47 | 10.62,45.47 10.62,46.67 10.88,46.92 11.76,46.92 U2.3 | U1.3 15.35,41.21 | 15.35,41.21 14.1,41.21 13.6,40.71 | 13.6,40.71 v13.6,39.73 14.06,39.27 15.3,39.27 U1.1 | 13.6,40.71 13.6,40.88 10.62,43.86 10.62,45.47 | U3.1 18.41,44.56 16.66,44.56 | 15.35,41.21 15.35,43.35 16.56,44.56 16.66,44.56 | 16.66,44.56 16.66,48.23 17.79,49.36 C12.1 | D4.C D9.C 27.29,30.78 23.89,30.78 v23.1,31.57 | D5.C 28.57,26.74 D4.C | v59.69,39.02 57.66,41.05 57.66,45.09 55.52,47.23 51.52,47.23 50.6,48.15 50.6,51.26 v50.68,51.34 | v19.62,57.23 19.62,55.78 19.91,55.49 20.72,55.49 20.75,55.52
  Bottom 0.406: 20.86,50.95 20.75,51.07 C5.1 20.75,55.52 20.75,55.58 C20.1 | 20.86,50.95 20.82,50.91 20.73,51.01 C12.1 | C11.1 20.86,50.95
R2IN
  Bottom 0.2: J5.4 39.48,44.14 40.17,43.45 42.83,43.45 45.74,46.36 55.27,46.36 56.48,45.14 U5.8
RST_LORA  (via drill 0.35)
  Top 0.2: MD1.11 v58.08,29.44
  Bottom 0.2: LORA-NICERF-V1.NRST 7.11,32.44 17.35,22.2 29.34,22.2 30.18,23.03 34.34,23.03 38.37,27.07 55.01,27.07 57.38,29.44 v58.08,29.44
RTS
  Bottom 0.2: Q1.2 56.44,12.67 55.55,11.78 50.42,11.78 49.35,12.86 46.76,12.86 45.93,13.68 R2.1 | R2.1 | R2.1 42,18.52 42,21.61 41.35,22.27 38.47,22.27 38.02,21.82 U$2.14
RX  (via drill 0.35)
  Top 0.2: D6.C 40.99,9.13 38.01,12.11 v38.01,13.56 38.01,14.25 38.64,14.88 40.85,14.88 41.53,15.56 41.53,19.38 40.35,20.56 MD1.35
  Bottom 0.2: v38.01,13.56 38.01,15.17 U$2.3
RX_DB9  (via drill 0.35)
  Top 0.2: v41.18,30.81 39.28,30.81 MD1.27
  Bottom 0.2: U5.9 57.6,36.57 59.64,34.52 59.64,32.82 58.57,31.75 56.84,31.75 53.99,28.9 43.09,28.9 v41.18,30.81
SCK_HSPI  (via drill 0.35)
  Top 0.2: v58.56,32.95 58.56,32.65 57.89,31.98 MD1.13
  Bottom 0.2: v58.56,32.95 57.03,32.95 53.98,29.9 49,29.9 42.78,36.11 9.75,36.11 8.96,36.91 8.96,44.81 7.65,46.11 U$3.SCLK
SCK_VSPI  (via drill 0.35)
  Top 0.2: v11.06,23.54 11.42,23.9 21.82,23.9 23.31,25.39 27.35,25.39 28.4,26.44 37.42,26.44 37.89,26.9 MD1.30
  Bottom 0.2: LORA-NICERF-V1.SCK 9.8,22.28 v11.06,23.54
SS_LAN_CONV  (via drill 0.35)
  Top 0.2: MD1.26 39.16,32 v37.67,32
  Bottom 0.2: U$3.CS 7.93,43.57 8.45,43.05 8.45,36.39 9.39,35.45 35.96,35.45 37.67,33.73 v37.67,32
SS_LORA  (via drill 0.35)
  Top 0.2: v9.57,26.08 9.61,26.12 26.83,26.12 29.33,28.61 37.8,28.61 38.24,28.17 MD1.29
  Bottom 0.2: LORA-NICERF-V1.NSS 9.57,26.09 v9.57,26.08
T2OUT
  Bottom 0.2: J5.5 38.21,43.88 39.64,42.44 42.91,42.44 46.19,45.72 54.51,45.72 55.21,45.03 U5.7
TX  (via drill 0.35)
  Top 0.2: D1.C 39.83,11.38 39.3,11.91 v39.3,13.67 | 39.3,13.38 v39.3,13.67 | MD1.34 39.92,21.82 42.05,19.69 42.05,15.28 40.44,13.67 v39.3,13.67
  Bottom 0.2: v39.3,13.67 v39.29,13.68 U$2.2
TX_DB9  (via drill 0.35)
  Top 0.2: v41.05,29.47 39.21,29.47 MD1.28
  Bottom 0.2: U5.10 55.21,38.46 55.96,39.21 57.98,39.21 58.78,38.41 58.78,36.19 60.15,34.81 60.15,32.62 58.71,31.18 57.05,31.18 54.16,28.28 42.24,28.28 v41.05,29.47
USB_N
  Bottom 0.2: U$2.6 34.21,14.02 34.65,13.59 34.65,9.08 34.25,8.68 34.25,6.25 34.89,5.61 J3.2
USB_P
  Bottom 0.2: U$2.5 35.48,14.02 35.05,13.59 35.05,12.41 arc90 35.4,12.05 36.09,12.05 arc-90 36.44,11.7 36.44,10.82 arc-90 36.09,10.47 35.4,10.47 arc90 35.05,10.12 35.05,9.08 37.09,7.04 J3.3
VCC  (via drill 0.35)
  Top 0.2: v35.15,4.48 35.15,6.47 J3.1 35.48,8.44 36.39,9.34 36.39,13.18 34.69,14.88 32.53,14.88 29.8,17.6 26.13,17.6 v25.25,18.48 24.7,19.03 24.7,22.98 24.4,23.28 v23.78,23.28 30.34,23.28 v31.05,23.99 | C25.+ 62.95,54.36 v62.95,51.32
  Bottom 0.2: v35.15,4.48 36.35,3.27 39.02,3.27 39.81,4.06 41.54,4.06 42.86,2.74 42.86,1.83 43.58,1.12 46.29,1.12 46.93,1.76 46.93,6.2 47.62,6.89 52.71,6.89 R4.2 53.98,7.76 55.86,9.64 R5.2 | D5.A 24.37,24.02 23.78,23.43 v23.78,23.28 | C1.1 31.01,24.03 v31.05,23.99 31.42,23.62 34.25,23.62 38.32,27.69 54.52,27.69 57.5,30.66 59.12,30.66 64.22,35.76 64.22,37.88 63.03,39.07 61.07,39.07 58.64,41.5 58.64,49.04 59.66,50.07 61.73,50.07 62.95,51.29 v62.95,51.32 | U$2.16 40.56,18.92 39.61,17.96 25.76,17.96 v25.25,18.48